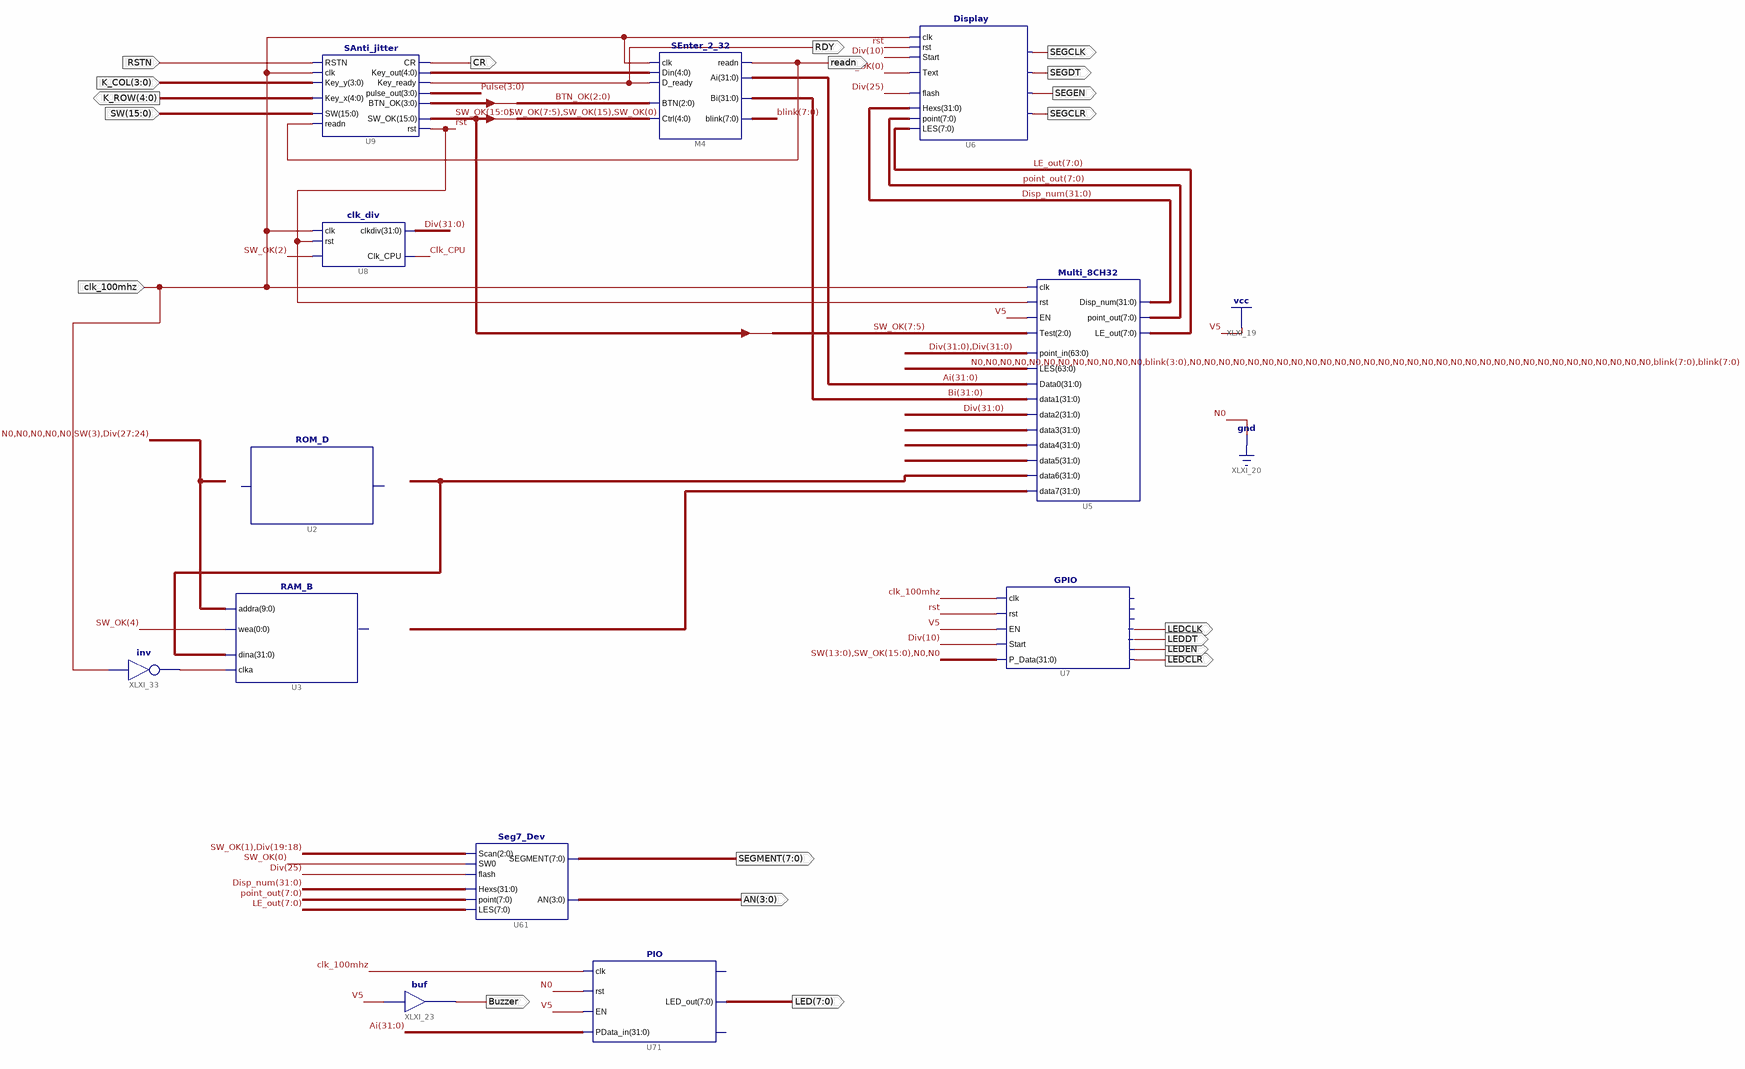
[diagram p0: schematic sheet 1]
// Xilinx ISE schematic OExp02.sch (kintex7) as structural Verilog: 12 symbols, 20 ports
module OExp02 (
  input  RSTN,
  input  [3:0] K_COL,
  input  [15:0] SW,
  input  clk_100mhz,
  output [4:0] K_ROW,
  output readn,
  output CR,
  output RDY,
  output SEGCLK,
  output SEGDT,
  output SEGEN,
  output SEGCLR,
  output [7:0] SEGMENT,
  output [3:0] AN,
  output Buzzer,
  output LEDCLR,
  output LEDEN,
  output LEDDT,
  output LEDCLK,
  output [7:0] LED
);

  wire Clk_CPU, rst, XLXN_95;
  wire [3:0] BTN_OK, Pulse;
  wire [4:0] XLXN_15;
  wire [7:0] blink, LE_out, point_out;
  wire [15:0] SW_OK;
  wire [31:0] Ai, Bi, Disp_num, Div, XLXN_47, XLXN_48, XLXN_49, XLXN_50, XLXN_51;

  Multi_8CH32 U5 (
    .Test(SW_OK[7:5]), .point_in({Div, Div}), .EN(1'b1), .clk(clk_100mhz), .rst(rst),
    .LES({{12{1'b0}}, blink[3:0], {32{1'b0}}, blink, blink}), .Data0(Ai), .data1(Bi), .data2(Div),
    .data3(XLXN_47), .data4(XLXN_48), .data5(XLXN_49), .data6(XLXN_50), .data7(XLXN_51),
    .point_out(point_out), .LE_out(LE_out), .Disp_num(Disp_num));
  SEnter_2_32 #(.VeriModel("SEnter_2_32")) M4 (
    .readn(readn), .Ai(Ai), .Bi(Bi), .blink(blink), .Din(XLXN_15), .D_ready(RDY), .clk(clk_100mhz),
    .Ctrl({SW_OK[7:5], SW_OK[15], SW_OK[0]}), .BTN(BTN_OK[2:0]));
  SAnti_jitter #(.VeriModel("SAnti_jitter")) U9 (
    .SW(SW), .readn(readn), .Key_y(K_COL), .Key_x(K_ROW), .RSTN(RSTN), .clk(clk_100mhz), .Key_out(XLXN_15),
    .Key_ready(RDY), .CR(CR), .rst(rst), .SW_OK(SW_OK), .pulse_out(Pulse), .BTN_OK(BTN_OK));
  ROM_D U2 ();  // open: a, spo
  RAM_B U3 (.addra({{5{1'b0}}, SW[3], Div[27:24]}), .clka(XLXN_95), .wea(SW_OK[4]), .dina(XLXN_50), .douta(XLXN_51));
  Seg7_Dev U61 (
    .LES(LE_out), .Scan({SW_OK[1], Div[19:18]}), .SEGMENT(SEGMENT), .AN(AN), .point(point_out),
    .flash(Div[25]), .SW0(SW_OK[0]), .Hexs(Disp_num));
  buf XLXI_23 (Buzzer, 1'b1);
  not XLXI_33 (XLXN_95, clk_100mhz);
  clk_div U8 (.rst(rst), .clk(clk_100mhz), .clkdiv(Div), .Clk_CPU(Clk_CPU));  // open: STEP
  Display U6 (
    .LES(LE_out), .point(point_out), .Hexs(Disp_num), .Text(SW_OK[0]), .flash(Div[25]), .clk(clk_100mhz),
    .rst(rst), .Start(Div[10]));  // open: SEGEN, segsout, segclrn, segclk
  GPIO U7 (
    .clk(clk_100mhz), .P_Data({SW[13:0], SW_OK, 2'b00}), .rst(rst), .EN(1'b1), .Start(Div[10]));  // open: ledclk, GPIOf0, LED_out, counter_set, ledclrn, LEDEN, ledsout
  PIO U71 (.clk(clk_100mhz), .rst(1'b0), .EN(1'b1), .PData_in(Ai), .LED_out(LED));  // open: GPIOf0, counter_set
endmodule
